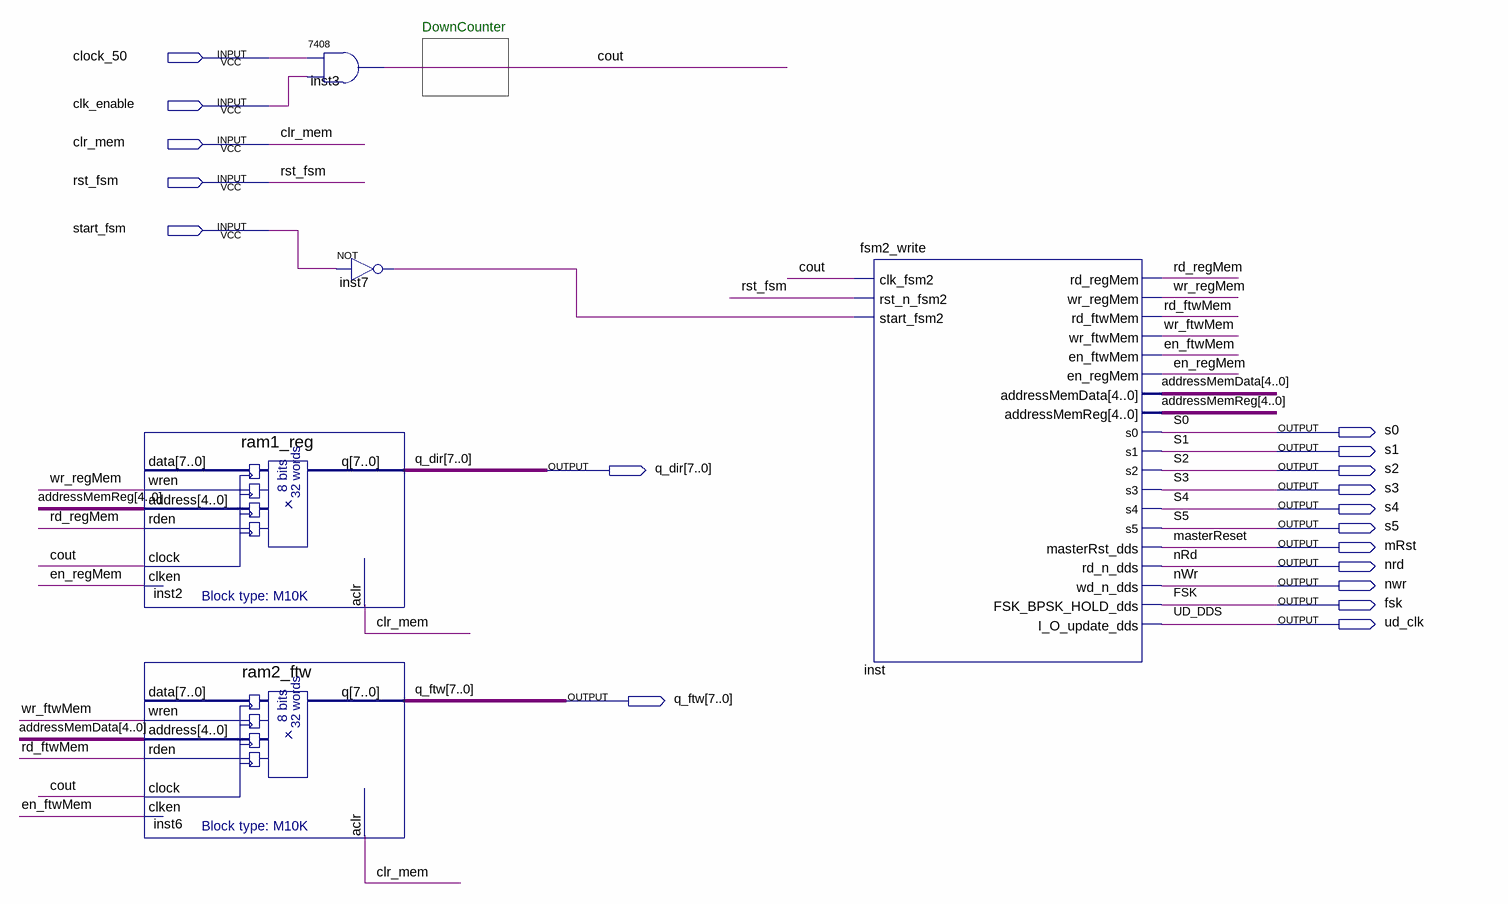
[diagram p0: schematic sheet]
// Quartus schematic fsm2_block.bdf as structural Verilog: 5 symbols, 18 pins
module fsm2_block (
  input  clock_50,
  input  clk_enable,
  input  clr_mem,
  input  rst_fsm,
  input  start_fsm,
  output s0,
  output s1,
  output [7:0] q_dir,
  output s2,
  output s3,
  output s4,
  output s5,
  output mRst,
  output nrd,
  output nwr,
  output fsk,
  output ud_clk,
  output [7:0] q_ftw
);

  wire cout, en_ftwMem, en_regMem, inst7_out, rd_ftwMem, rd_regMem, wr_ftwMem, wr_regMem;
  wire [4:0] addressMemData, addressMemReg;

  ram1_reg inst2 (
    .wren(wr_regMem), .address(addressMemReg), .rden(rd_regMem), .clock(cout), .clken(en_regMem),
    .aclr(clr_mem), .q(q_dir));  // open: data
  ram2_ftw inst6 (
    .wren(wr_ftwMem), .address(addressMemData), .rden(rd_ftwMem), .clock(cout), .clken(en_ftwMem),
    .aclr(clr_mem), .q(q_ftw));  // open: data
  \7408  inst3 (.\3 (clk_enable), .\2 (clock_50), .\1 (cout));
  not inst7 (inst7_out, start_fsm);
  fsm2_write inst (
    .clk_fsm2(cout), .rst_n_fsm2(rst_fsm), .start_fsm2(inst7_out), .rd_regMem(rd_regMem),
    .wr_regMem(wr_regMem), .rd_ftwMem(rd_ftwMem), .wr_ftwMem(wr_ftwMem), .en_ftwMem(en_ftwMem),
    .en_regMem(en_regMem), .addressMemData(addressMemData), .addressMemReg(addressMemReg), .s0(s0), .s1(s1),
    .s2(s2), .s3(s3), .s4(s4), .s5(s5), .masterRst_dds(mRst), .rd_n_dds(nrd), .wd_n_dds(nwr),
    .FSK_BPSK_HOLD_dds(fsk), .I_O_update_dds(ud_clk));

  // Other names for the same wires on the sheet: masterReset = mRst; UD_DDS = ud_clk

  // Notes on the sheet:
  //   DownCounter
endmodule
